# Altium project Isolated Gate driver.PrjPcb
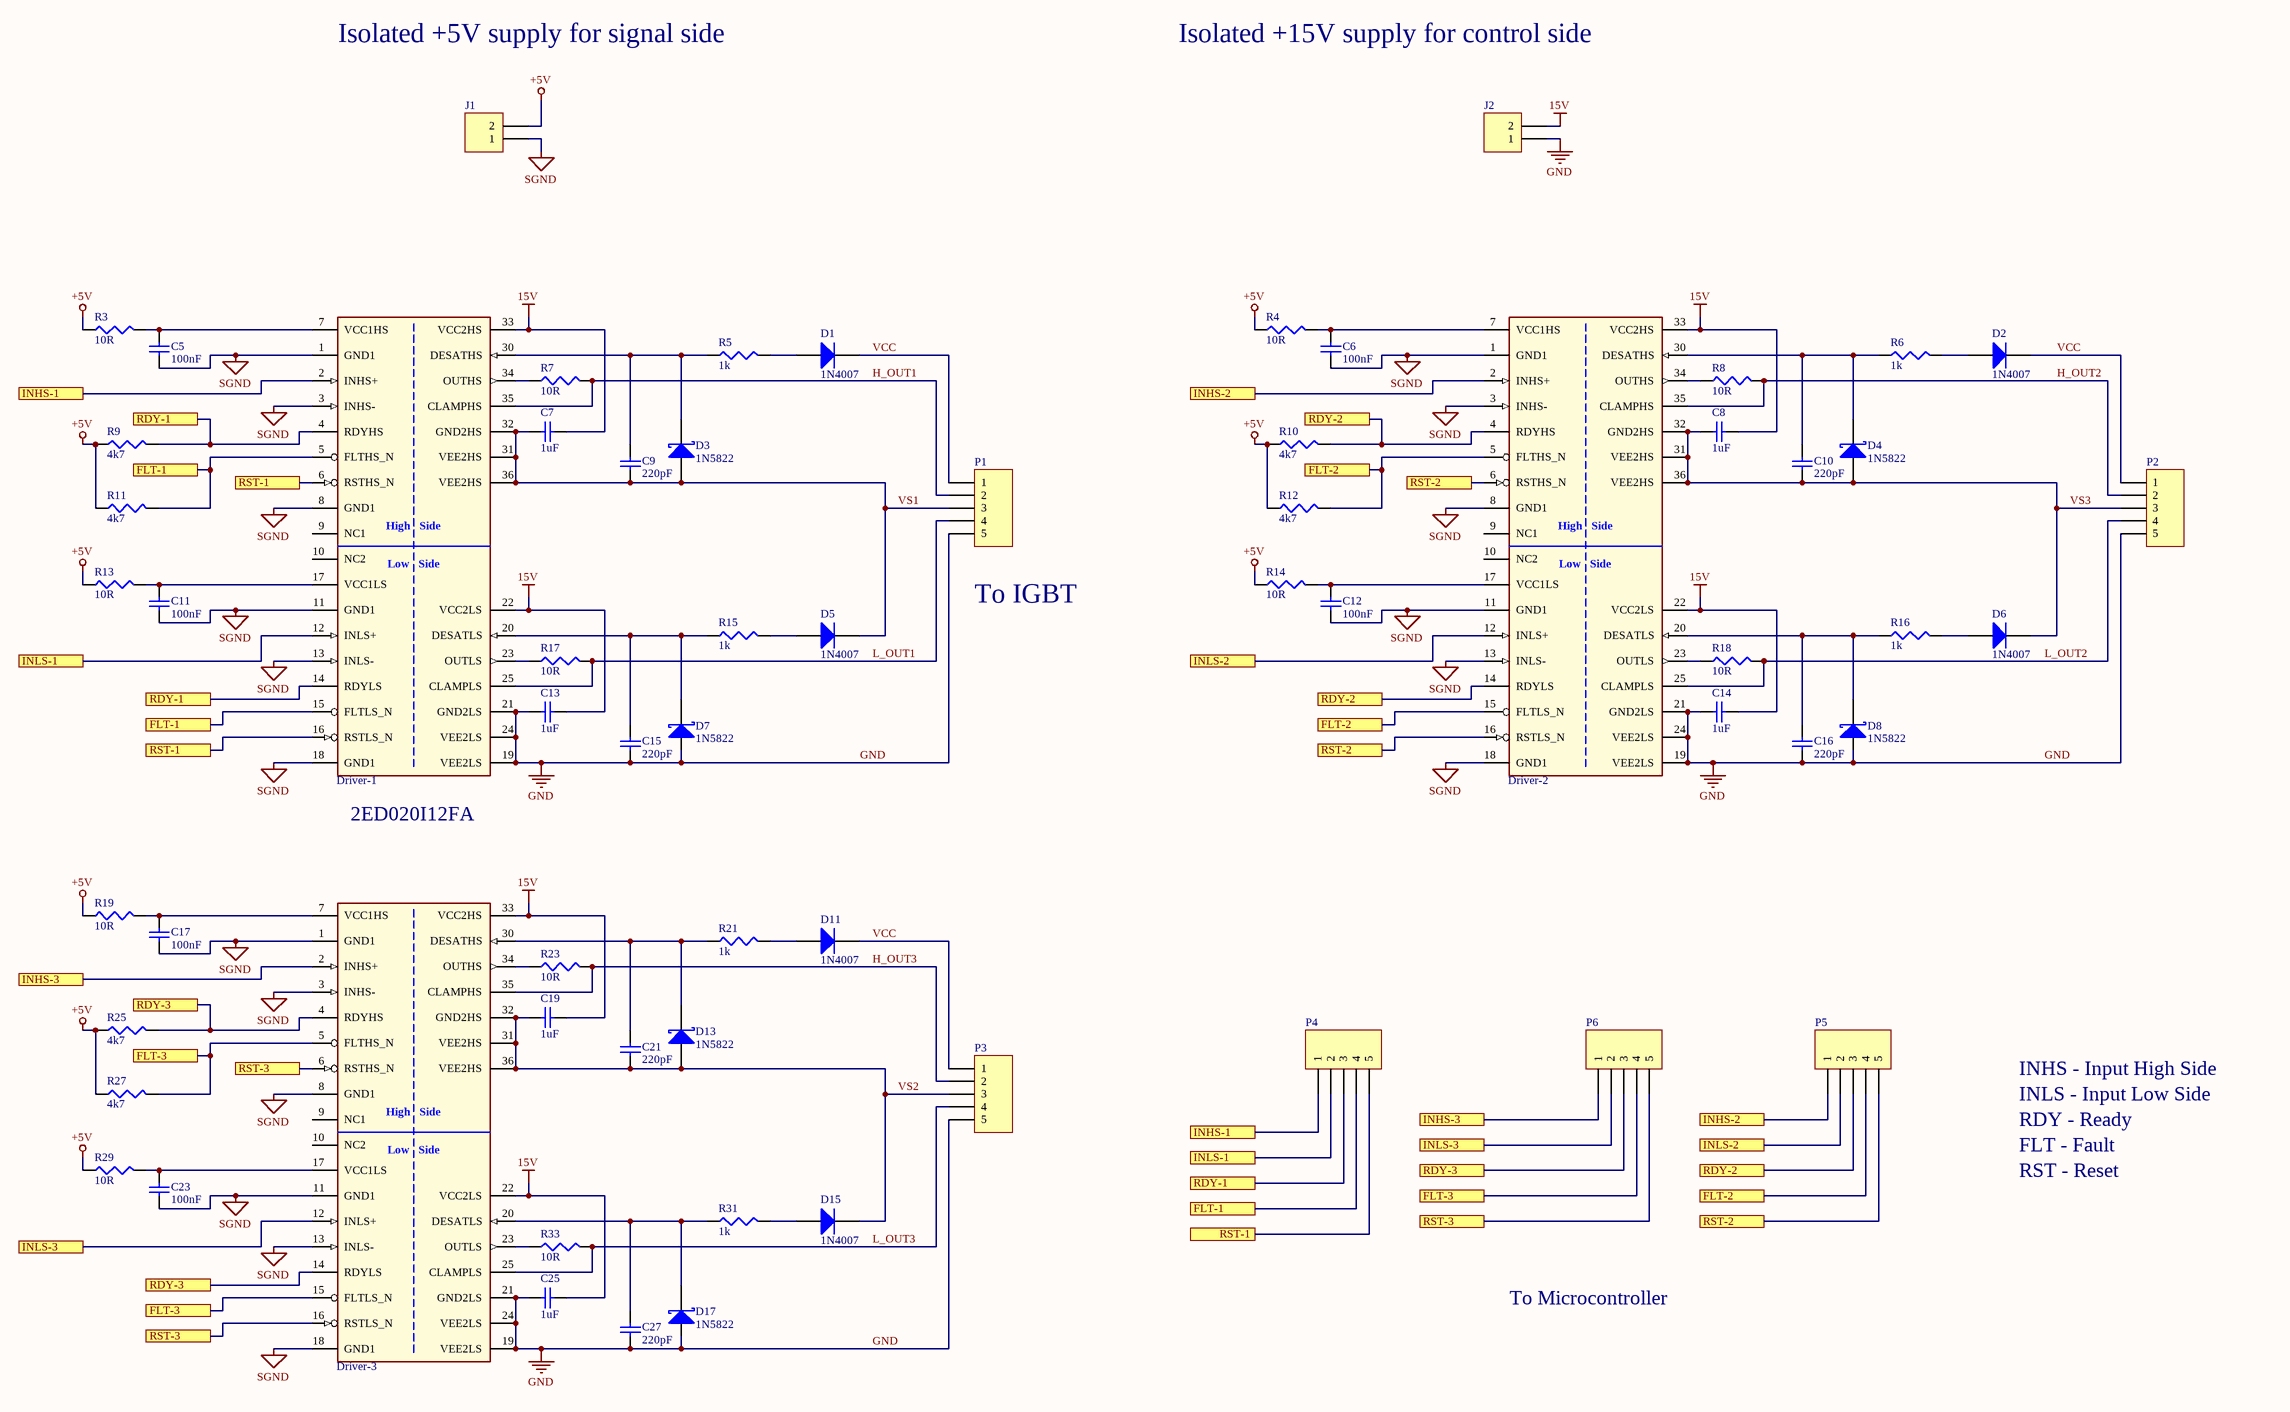
[diagram p0: Isolated_gate_drive.SchDoc]
1 sheet, 65 parts. Net scope: flat (ports and power ports of the same name join across sheets).
Board file: Isolated_gate_driver.PcbDoc

## Sheet Isolated_gate_drive.SchDoc
size C

### Parts
C5  value 100nF  [C0805]  (hidden comment: Cap)
C6  value 100nF  [C0805]  (hidden comment: Cap)
C7  value 1uF  [C0805]  (hidden comment: Cap)
C8  value 1uF  [C0805]  (hidden comment: Cap)
C9  value 220pF  [C0805]  (hidden comment: Cap)
C10  value 220pF  [C0805]  (hidden comment: Cap)
C11  value 100nF  [C0805]  (hidden comment: Cap)
C12  value 100nF  [C0805]  (hidden comment: Cap)
C13  value 1uF  [C0805]  (hidden comment: Cap)
C14  value 1uF  [C0805]  (hidden comment: Cap)
C15  value 220pF  [C0805]  (hidden comment: Cap)
C16  value 220pF  [C0805]  (hidden comment: Cap)
C17  value 100nF  [C0805]  (hidden comment: Cap)
C19  value 1uF  [C0805]  (hidden comment: Cap)
C21  value 220pF  [C0805]  (hidden comment: Cap)
C23  value 100nF  [C0805]  (hidden comment: Cap)
C25  value 1uF  [C0805]  (hidden comment: Cap)
C27  value 220pF  [C0805]  (hidden comment: Cap)
D1  1N4007  [M7 SMA]
D2  1N4007  [M7 SMA]
D3  1N5822  [SMB]
D4  1N5822  [SMB]
D5  1N4007  [M7 SMA]
D6  1N4007  [M7 SMA]
D7  1N5822  [SMB]
D8  1N5822  [SMB]
D11  1N4007  [M7 SMA]
D13  1N5822  [SMB]
D15  1N4007  [M7 SMA]
D17  1N5822  [SMB]
Driver-1  2ED020I12FA  [SOP65P1030X265-36_32N-V]  (value not drawn)
Driver-2  2ED020I12FA  [SOP65P1030X265-36_32N-V]  (value not drawn)
Driver-3  2ED020I12FA  [SOP65P1030X265-36_32N-V]  (value not drawn)
J1  Header 2  [HDR1X2]  (value not drawn)
J2  Header 2  [HDR1X2]  (value not drawn)
P1  Header 5  [HDR1X5]  (value not drawn)
P2  Header 5  [HDR1X5]  (value not drawn)
P3  Header 5  [HDR1X5]  (value not drawn)
P4  Header 5  [HDR1X5]  (value not drawn)
P5  Header 5  [HDR1X5]  (value not drawn)
P6  Header 5  [HDR1X5]  (value not drawn)
R3  value 10R  [C1206]  (hidden comment: Res3)
R4  value 10R  [C1206]  (hidden comment: Res3)
R5  value 1k  [C1206]  (hidden comment: Res3)
R6  value 1k  [C1206]  (hidden comment: Res3)
R7  value 10R  [C1206]  (hidden comment: Res3)
R8  value 10R  [C1206]  (hidden comment: Res3)
R9  value 4k7  [C1206]  (hidden comment: Res3)
R10  value 4k7  [C1206]  (hidden comment: Res3)
R11  value 4k7  [C1206]  (hidden comment: Res3)
R12  value 4k7  [C1206]  (hidden comment: Res3)
R13  value 10R  [C1206]  (hidden comment: Res3)
R14  value 10R  [C1206]  (hidden comment: Res3)
R15  value 1k  [C1206]  (hidden comment: Res3)
R16  value 1k  [C1206]  (hidden comment: Res3)
R17  value 10R  [C1206]  (hidden comment: Res3)
R18  value 10R  [C1206]  (hidden comment: Res3)
R19  value 10R  [C1206]  (hidden comment: Res3)
R21  value 1k  [C1206]  (hidden comment: Res3)
R23  value 10R  [C1206]  (hidden comment: Res3)
R25  value 4k7  [C1206]  (hidden comment: Res3)
R27  value 4k7  [C1206]  (hidden comment: Res3)
R29  value 10R  [C1206]  (hidden comment: Res3)
R31  value 1k  [C1206]  (hidden comment: Res3)
R33  value 10R  [C1206]  (hidden comment: Res3)

### Ports
FLT-1, FLT-2, FLT-3, INHS-1, INHS-2, INHS-3, INLS-1, INLS-2, INLS-3, RDY-1, RDY-2, RDY-3, RST-1, RST-2, RST-3

### Nets
15V: C7.2 C8.2 C13.2 C14.2 C19.2 C25.2 Driver-1.22(VCC2LS) Driver-1.33(VCC2HS) Driver-2.22(VCC2LS) Driver-2.33(VCC2HS) Driver-3.22(VCC2LS) Driver-3.33(VCC2HS) J2.2
+5V: J1.2 R3.1 R4.1 R9.1 R10.1 R11.1 R12.1 R13.1 R14.1 R19.1 R25.1 R27.1 R29.1
GND: C13.1 C14.1 C15.2 C16.2 C25.1 C27.2 D7.1(A) D8.1(A) D17.1(A) Driver-1.19(VEE2LS) Driver-1.21(GND2LS) Driver-1.24(VEE2LS) Driver-2.19(VEE2LS) Driver-2.21(GND2LS) Driver-2.24(VEE2LS) Driver-3.19(VEE2LS) Driver-3.21(GND2LS) Driver-3.24(VEE2LS) J2.1 P1.5 P2.5 P3.5
SGND: C5.2 C6.2 C11.2 C12.2 C17.2 C23.2 Driver-1.1(GND1) Driver-1.3(INHS-) Driver-1.8(GND1) Driver-1.11(GND1) Driver-1.13(INLS-) Driver-1.18(GND1) Driver-2.1(GND1) Driver-2.3(INHS-) Driver-2.8(GND1) Driver-2.11(GND1) Driver-2.13(INLS-) Driver-2.18(GND1) Driver-3.1(GND1) Driver-3.3(INHS-) Driver-3.8(GND1) Driver-3.11(GND1) Driver-3.13(INLS-) Driver-3.18(GND1) J1.1
H_OUT1: Driver-1.35(CLAMPHS) P1.2 R7.2
H_OUT2: Driver-2.35(CLAMPHS) P2.2 R8.2
H_OUT3: Driver-3.35(CLAMPHS) P3.2 R23.2
L_OUT1: Driver-1.25(CLAMPLS) P1.4 R17.2
L_OUT2: Driver-2.25(CLAMPLS) P2.4 R18.2
L_OUT3: Driver-3.25(CLAMPLS) P3.4 R33.2
VCC: D1.2(K) D2.2(K) D11.2(K) P1.1 P2.1 P3.1
VS1: C7.1 C9.2 D3.1(A) D5.2(K) Driver-1.31(VEE2HS) Driver-1.32(GND2HS) Driver-1.36(VEE2HS) P1.3
VS2: C19.1 C21.2 D13.1(A) D15.2(K) Driver-3.31(VEE2HS) Driver-3.32(GND2HS) Driver-3.36(VEE2HS) P3.3
VS3: C8.1 C10.2 D4.1(A) D6.2(K) Driver-2.31(VEE2HS) Driver-2.32(GND2HS) Driver-2.36(VEE2HS) P2.3
NetC5_1: C5.1 Driver-1.7(VCC1HS) R3.2
NetC6_1: C6.1 Driver-2.7(VCC1HS) R4.2
NetC9_1: C9.1 D3.2(K) Driver-1.30(DESATHS) R5.1
NetC10_1: C10.1 D4.2(K) Driver-2.30(DESATHS) R6.1
NetC11_1: C11.1 Driver-1.17(VCC1LS) R13.2
NetC12_1: C12.1 Driver-2.17(VCC1LS) R14.2
NetC15_1: C15.1 D7.2(K) Driver-1.20(DESATLS) R15.1
NetC16_1: C16.1 D8.2(K) Driver-2.20(DESATLS) R16.1
NetC17_1: C17.1 Driver-3.7(VCC1HS) R19.2
NetC21_1: C21.1 D13.2(K) Driver-3.30(DESATHS) R21.1
NetC23_1: C23.1 Driver-3.17(VCC1LS) R29.2
NetC27_1: C27.1 D17.2(K) Driver-3.20(DESATLS) R31.1
NetD1_1: D1.1(A) R5.2
NetD2_1: D2.1(A) R6.2
NetD5_1: D5.1(A) R15.2
NetD6_1: D6.1(A) R16.2
NetD11_1: D11.1(A) R21.2
NetD15_1: D15.1(A) R31.2
NetDriver-1_2: Driver-1.2(INHS+) P4.1 ; port INHS-1
NetDriver-1_4: Driver-1.4(RDYHS) Driver-1.14(RDYLS) P4.3 R9.2 ; port RDY-1
NetDriver-1_5: Driver-1.5(FLTHS_N) Driver-1.15(FLTLS_N) P4.4 R11.2 ; port FLT-1
NetDriver-1_6: Driver-1.6(RSTHS_N) Driver-1.16(RSTLS_N) P4.5 ; port RST-1
NetDriver-1_12: Driver-1.12(INLS+) P4.2 ; port INLS-1
NetDriver-1_23: Driver-1.23(OUTLS) R17.1
NetDriver-1_34: Driver-1.34(OUTHS) R7.1
NetDriver-2_2: Driver-2.2(INHS+) P5.1 ; port INHS-2
NetDriver-2_4: Driver-2.4(RDYHS) Driver-2.14(RDYLS) P5.3 R10.2 ; port RDY-2
NetDriver-2_5: Driver-2.5(FLTHS_N) Driver-2.15(FLTLS_N) P5.4 R12.2 ; port FLT-2
NetDriver-2_6: Driver-2.6(RSTHS_N) Driver-2.16(RSTLS_N) P5.5 ; port RST-2
NetDriver-2_12: Driver-2.12(INLS+) P5.2 ; port INLS-2
NetDriver-2_23: Driver-2.23(OUTLS) R18.1
NetDriver-2_34: Driver-2.34(OUTHS) R8.1
NetDriver-3_2: Driver-3.2(INHS+) P6.1 ; port INHS-3
NetDriver-3_4: Driver-3.4(RDYHS) Driver-3.14(RDYLS) P6.3 R25.2 ; port RDY-3
NetDriver-3_5: Driver-3.5(FLTHS_N) Driver-3.15(FLTLS_N) P6.4 R27.2 ; port FLT-3
NetDriver-3_6: Driver-3.6(RSTHS_N) Driver-3.16(RSTLS_N) P6.5 ; port RST-3
NetDriver-3_12: Driver-3.12(INLS+) P6.2 ; port INLS-3
NetDriver-3_23: Driver-3.23(OUTLS) R33.1
NetDriver-3_34: Driver-3.34(OUTHS) R23.1

Not connected (* = marked no-connect by the designer): Driver-1 9(NC1) 10(NC2); Driver-2 9(NC1) 10(NC2); Driver-3 9(NC1) 10(NC2)

### Notes on the sheet
- Isolated +5V supply for signal side
- Isolated +15V supply for control side
- (near P1) To IGBT
- (near Driver-1) 2ED020I12FA
- INHS - Input High Side
- INLS - Input Low Side
- RDY - Ready
- FLT - Fault
- RST - Reset
- To Microcontroller
- (in symbol 2ED020I12FA) High   Side; Low   Side

### Library data of the parts
C5-C17 C19 C21 C23 C25 C27 = Cap: Capacitor; Published: 8-Jun-2000; LatestRevisionDate: 17-Jul-2002; LatestRevisionNote: Re-released for DXP Platform.; PackageReference: RAD-0.3; Publisher: Altium Limited; PackageDescription: Radial Cap, Thru-Hole; 2 Leads; 0.3 in Pin Spacing
D1 D2 D5 D6 D11 D15 = Diode: Default Diode; Published: 8-Jun-2000; LatestRevisionDate: 17-Jul-2002; LatestRevisionNote: Re-released for DXP Platform.; PackageVersion: Sep-1996; PackageReference: SMC; Publisher: Altium Limited; PackageDescription: DO-214-AB/SMC; 2 C-Bend Leads; Body 7.9 x 5.9 mm, inc. leads (LxW); Code_JEDEC: DO-214-AB
D3 D4 D7 D8 D13 D17 = D Schottky: Schottky Diode; Published: 8-Jun-2000; LatestRevisionDate: 17-Jul-2002; LatestRevisionNote: Re-released for DXP Platform.; PackageReference: SMB; Publisher: Altium Limited; PackageDescription: DO-214-AA/SMB; 2 C-Bend Leads; Body 5.3 x 3.6 mm, inc. leads (LxW); Code_JEDEC: DO-214-AA
Driver-1-Driver-3 = 2ED020I12FA: Dual IGBT Driver IC; Manufacturer: Infineon Technologies; ManufacturerPartNumber: 2ED020I12FA; PackageReference: PG-DSO-36
J1 J2 = Header 2: Header, 2-Pin; LatestRevisionDate: 17-Jul-2002; LatestRevisionNote: Re-released for DXP Platform.; Publisher: Altium Limited
P1-P6 = Header 5: Header, 5-Pin; LatestRevisionDate: 17-Jul-2002; LatestRevisionNote: Re-released for DXP Platform.; Publisher: Altium Limited
R3-R19 R21 R23 R25 R27 R29 R31 R33 = Res3: Resistor; Published: 8-Jun-2000; LatestRevisionDate: 29-May-2009; LatestRevisionNote: IPC-7351 Footprint Added.; PackageReference: J1-0603; Publisher: Altium Limited; PackageDescription: Chip Resistor